# Altium schematic sheet 5_移位寄存器部分.schdoc.schdoc
size 431 x 309 mm; Symbol: Sheet-Symbol_A3; Device: Sheet-Symbol_A3; Company: 深圳嘉立创科技发展有限公司; Drawed: 嘉立创EDA; Reviewed: 嘉立创EDA; Version: V0.1; Page Size: A2; @Project Name: 毕业设计板子1; @Page Count: 3; @Update Date: 2024-02-22; @Create Date: 2024-02-22; @Schematic Name: Schematic1; Part Number: JLCPCB-001; @Page No: 3; @Page Name: 移位寄存器部分
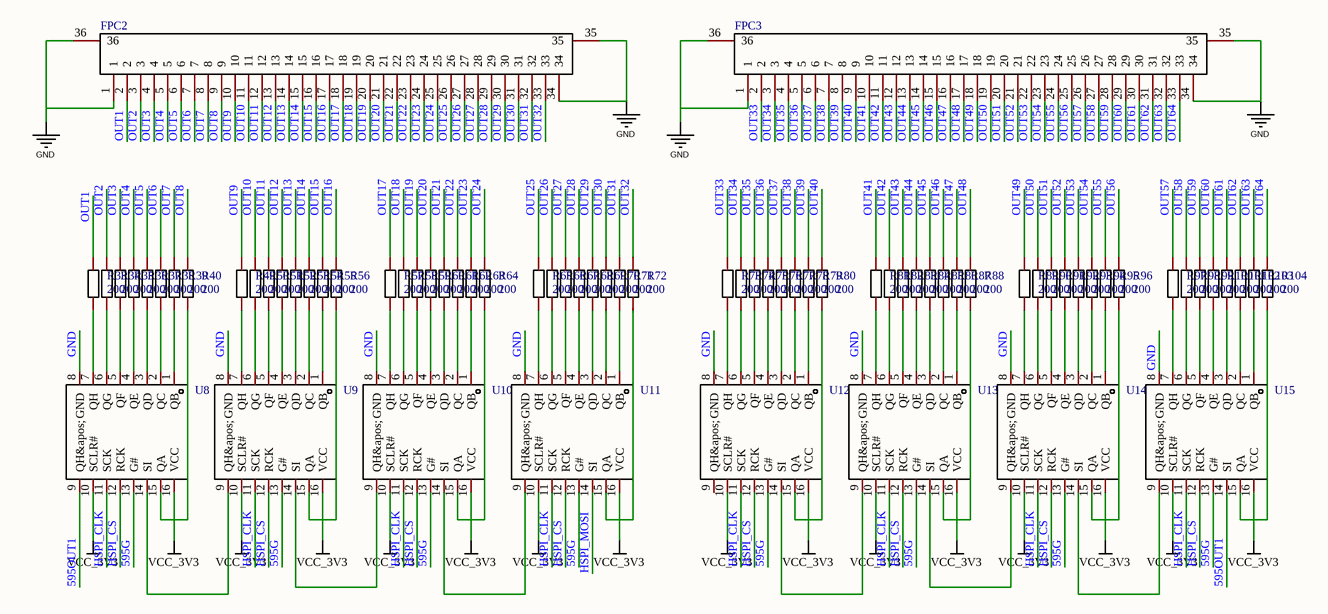
[diagram p0: 5_移位寄存器部分.schdoc.schdoc]

## Parts
FPC2  AFC07-S34FCC-00  [FPC-SMD_P0.50-34P_LCSXJ-H2.0]  (value not drawn)
FPC3  AFC07-S34FCC-00  [FPC-SMD_P0.50-34P_LCSXJ-H2.0]  (value not drawn)
R33  value 200  [R0402]  (hidden comment: Res_0402)
R34  value 200  [R0402]  (hidden comment: Res_0402)
R35  value 200  [R0402]  (hidden comment: Res_0402)
R36  value 200  [R0402]  (hidden comment: Res_0402)
R37  value 200  [R0402]  (hidden comment: Res_0402)
R38  value 200  [R0402]  (hidden comment: Res_0402)
R39  value 200  [R0402]  (hidden comment: Res_0402)
R40  value 200  [R0402]  (hidden comment: Res_0402)
R49  value 200  [R0402]  (hidden comment: Res_0402)
R50  value 200  [R0402]  (hidden comment: Res_0402)
R51  value 200  [R0402]  (hidden comment: Res_0402)
R52  value 200  [R0402]  (hidden comment: Res_0402)
R53  value 200  [R0402]  (hidden comment: Res_0402)
R54  value 200  [R0402]  (hidden comment: Res_0402)
R55  value 200  [R0402]  (hidden comment: Res_0402)
R56  value 200  [R0402]  (hidden comment: Res_0402)
R57  value 200  [R0402]  (hidden comment: Res_0402)
R58  value 200  [R0402]  (hidden comment: Res_0402)
R59  value 200  [R0402]  (hidden comment: Res_0402)
R60  value 200  [R0402]  (hidden comment: Res_0402)
R61  value 200  [R0402]  (hidden comment: Res_0402)
R62  value 200  [R0402]  (hidden comment: Res_0402)
R63  value 200  [R0402]  (hidden comment: Res_0402)
R64  value 200  [R0402]  (hidden comment: Res_0402)
R65  value 200  [R0402]  (hidden comment: Res_0402)
R66  value 200  [R0402]  (hidden comment: Res_0402)
R67  value 200  [R0402]  (hidden comment: Res_0402)
R68  value 200  [R0402]  (hidden comment: Res_0402)
R69  value 200  [R0402]  (hidden comment: Res_0402)
R70  value 200  [R0402]  (hidden comment: Res_0402)
R71  value 200  [R0402]  (hidden comment: Res_0402)
R72  value 200  [R0402]  (hidden comment: Res_0402)
R73  value 200  [R0402]  (hidden comment: Res_0402)
R74  value 200  [R0402]  (hidden comment: Res_0402)
R75  value 200  [R0402]  (hidden comment: Res_0402)
R76  value 200  [R0402]  (hidden comment: Res_0402)
R77  value 200  [R0402]  (hidden comment: Res_0402)
R78  value 200  [R0402]  (hidden comment: Res_0402)
R79  value 200  [R0402]  (hidden comment: Res_0402)
R80  value 200  [R0402]  (hidden comment: Res_0402)
R81  value 200  [R0402]  (hidden comment: Res_0402)
R82  value 200  [R0402]  (hidden comment: Res_0402)
R83  value 200  [R0402]  (hidden comment: Res_0402)
R84  value 200  [R0402]  (hidden comment: Res_0402)
R85  value 200  [R0402]  (hidden comment: Res_0402)
R86  value 200  [R0402]  (hidden comment: Res_0402)
R87  value 200  [R0402]  (hidden comment: Res_0402)
R88  value 200  [R0402]  (hidden comment: Res_0402)
R89  value 200  [R0402]  (hidden comment: Res_0402)
R90  value 200  [R0402]  (hidden comment: Res_0402)
R91  value 200  [R0402]  (hidden comment: Res_0402)
R92  value 200  [R0402]  (hidden comment: Res_0402)
R93  value 200  [R0402]  (hidden comment: Res_0402)
R94  value 200  [R0402]  (hidden comment: Res_0402)
R95  value 200  [R0402]  (hidden comment: Res_0402)
R96  value 200  [R0402]  (hidden comment: Res_0402)
R97  value 200  [R0402]  (hidden comment: Res_0402)
R98  value 200  [R0402]  (hidden comment: Res_0402)
R99  value 200  [R0402]  (hidden comment: Res_0402)
R100  value 200  [R0402]  (hidden comment: Res_0402)
R101  value 200  [R0402]  (hidden comment: Res_0402)
R102  value 200  [R0402]  (hidden comment: Res_0402)
R103  value 200  [R0402]  (hidden comment: Res_0402)
R104  value 200  [R0402]  (hidden comment: Res_0402)
U8  74HC595D_C431479  [SOIC-16_L9.9-W3.9-P1.27-LS6.0-BL]  (value not drawn)
U9  74HC595D_C431479  [SOIC-16_L9.9-W3.9-P1.27-LS6.0-BL]  (value not drawn)
U10  74HC595D_C431479  [SOIC-16_L9.9-W3.9-P1.27-LS6.0-BL]  (value not drawn)
U11  74HC595D_C431479  [SOIC-16_L9.9-W3.9-P1.27-LS6.0-BL]  (value not drawn)
U12  74HC595D_C431479  [SOIC-16_L9.9-W3.9-P1.27-LS6.0-BL]  (value not drawn)
U13  74HC595D_C431479  [SOIC-16_L9.9-W3.9-P1.27-LS6.0-BL]  (value not drawn)
U14  74HC595D_C431479  [SOIC-16_L9.9-W3.9-P1.27-LS6.0-BL]  (value not drawn)
U15  74HC595D_C431479  [SOIC-16_L9.9-W3.9-P1.27-LS6.0-BL]  (value not drawn)

## Nets
GND: FPC2.1 FPC2.34 FPC2.35 FPC2.36 FPC3.1 FPC3.34 FPC3.35 FPC3.36 U8.8(GND) U9.8(GND) U10.8(GND) U11.8(GND) U12.8(GND) U13.8(GND) U14.8(GND) U15.8(GND)
VCC_3V3: U8.10(SCLR#) U8.16(VCC) U9.10(SCLR#) U9.16(VCC) U10.10(SCLR#) U10.16(VCC) U11.10(SCLR#) U11.16(VCC) U12.10(SCLR#) U12.16(VCC) U13.10(SCLR#) U13.16(VCC) U14.10(SCLR#) U14.16(VCC) U15.10(SCLR#) U15.16(VCC)
595G: U8.13(G#) U9.13(G#) U10.13(G#) U11.13(G#) U12.13(G#) U13.13(G#) U14.13(G#) U15.13(G#)
595OUT1: U8.9(QH&apos;) U15.14(SI)
HSPI_CLK: U8.11(SCK) U9.11(SCK) U10.11(SCK) U11.11(SCK) U12.11(SCK) U13.11(SCK) U14.11(SCK) U15.11(SCK)
HSPI_CS: U8.12(RCK) U9.12(RCK) U10.12(RCK) U11.12(RCK) U12.12(RCK) U13.12(RCK) U14.12(RCK) U15.12(RCK)
HSPI_MOSI: U11.14(SI)
OUT1: FPC2.2 R33.2
OUT2: FPC2.3 R34.2
OUT3: FPC2.4 R35.2
OUT4: FPC2.5 R36.2
OUT5: FPC2.6 R37.2
OUT6: FPC2.7 R38.2
OUT7: FPC2.8 R39.2
OUT8: FPC2.9 R40.2
OUT9: FPC2.10 R49.2
OUT10: FPC2.11 R50.2
OUT11: FPC2.12 R51.2
OUT12: FPC2.13 R52.2
OUT13: FPC2.14 R53.2
OUT14: FPC2.15 R54.2
OUT15: FPC2.16 R55.2
OUT16: FPC2.17 R56.2
OUT17: FPC2.18 R57.2
OUT18: FPC2.19 R58.2
OUT19: FPC2.20 R59.2
OUT20: FPC2.21 R60.2
OUT21: FPC2.22 R61.2
OUT22: FPC2.23 R62.2
OUT23: FPC2.24 R63.2
OUT24: FPC2.25 R64.2
OUT25: FPC2.26 R65.2
OUT26: FPC2.27 R66.2
OUT27: FPC2.28 R67.2
OUT28: FPC2.29 R68.2
OUT29: FPC2.30 R69.2
OUT30: FPC2.31 R70.2
OUT31: FPC2.32 R71.2
OUT32: FPC2.33 R72.2
OUT33: FPC3.2 R73.2
OUT34: FPC3.3 R74.2
OUT35: FPC3.4 R75.2
OUT36: FPC3.5 R76.2
OUT37: FPC3.6 R77.2
OUT38: FPC3.7 R78.2
OUT39: FPC3.8 R79.2
OUT40: FPC3.9 R80.2
OUT41: FPC3.10 R81.2
OUT42: FPC3.11 R82.2
OUT43: FPC3.12 R83.2
OUT44: FPC3.13 R84.2
OUT45: FPC3.14 R85.2
OUT46: FPC3.15 R86.2
OUT47: FPC3.16 R87.2
OUT48: FPC3.17 R88.2
OUT49: FPC3.18 R89.2
OUT50: FPC3.19 R90.2
OUT51: FPC3.20 R91.2
OUT52: FPC3.21 R92.2
OUT53: FPC3.22 R93.2
OUT54: FPC3.23 R94.2
OUT55: FPC3.24 R95.2
OUT56: FPC3.25 R96.2
OUT57: FPC3.26 R97.2
OUT58: FPC3.27 R98.2
OUT59: FPC3.28 R99.2
OUT60: FPC3.29 R100.2
OUT61: FPC3.30 R101.2
OUT62: FPC3.31 R102.2
OUT63: FPC3.32 R103.2
OUT64: FPC3.33 R104.2
NetR33_1: R33.1 U8.7(QH)
NetR34_1: R34.1 U8.6(QG)
NetR35_1: R35.1 U8.5(QF)
NetR36_1: R36.1 U8.4(QE)
NetR37_1: R37.1 U8.3(QD)
NetR38_1: R38.1 U8.2(QC)
NetR39_1: R39.1 U8.1(QB)
NetR40_1: R40.1 U8.15(QA)
NetR49_1: R49.1 U9.7(QH)
NetR50_1: R50.1 U9.6(QG)
NetR51_1: R51.1 U9.5(QF)
NetR52_1: R52.1 U9.4(QE)
NetR53_1: R53.1 U9.3(QD)
NetR54_1: R54.1 U9.2(QC)
NetR55_1: R55.1 U9.1(QB)
NetR56_1: R56.1 U9.15(QA)
NetR57_1: R57.1 U10.7(QH)
NetR58_1: R58.1 U10.6(QG)
NetR59_1: R59.1 U10.5(QF)
NetR60_1: R60.1 U10.4(QE)
NetR61_1: R61.1 U10.3(QD)
NetR62_1: R62.1 U10.2(QC)
NetR63_1: R63.1 U10.1(QB)
NetR64_1: R64.1 U10.15(QA)
NetR65_1: R65.1 U11.7(QH)
NetR66_1: R66.1 U11.6(QG)
NetR67_1: R67.1 U11.5(QF)
NetR68_1: R68.1 U11.4(QE)
NetR69_1: R69.1 U11.3(QD)
NetR70_1: R70.1 U11.2(QC)
NetR71_1: R71.1 U11.1(QB)
NetR72_1: R72.1 U11.15(QA)
NetR73_1: R73.1 U12.7(QH)
NetR74_1: R74.1 U12.6(QG)
NetR75_1: R75.1 U12.5(QF)
NetR76_1: R76.1 U12.4(QE)
NetR77_1: R77.1 U12.3(QD)
NetR78_1: R78.1 U12.2(QC)
NetR79_1: R79.1 U12.1(QB)
NetR80_1: R80.1 U12.15(QA)
NetR81_1: R81.1 U13.7(QH)
NetR82_1: R82.1 U13.6(QG)
NetR83_1: R83.1 U13.5(QF)
NetR84_1: R84.1 U13.4(QE)
NetR85_1: R85.1 U13.3(QD)
NetR86_1: R86.1 U13.2(QC)
NetR87_1: R87.1 U13.1(QB)
NetR88_1: R88.1 U13.15(QA)
NetR89_1: R89.1 U14.7(QH)
NetR90_1: R90.1 U14.6(QG)
NetR91_1: R91.1 U14.5(QF)
NetR92_1: R92.1 U14.4(QE)
NetR93_1: R93.1 U14.3(QD)
NetR94_1: R94.1 U14.2(QC)
NetR95_1: R95.1 U14.1(QB)
NetR96_1: R96.1 U14.15(QA)
NetR97_1: R97.1 U15.7(QH)
NetR98_1: R98.1 U15.6(QG)
NetR99_1: R99.1 U15.5(QF)
NetR100_1: R100.1 U15.4(QE)
NetR101_1: R101.1 U15.3(QD)
NetR102_1: R102.1 U15.2(QC)
NetR103_1: R103.1 U15.1(QB)
NetR104_1: R104.1 U15.15(QA)
NetU8_14: U8.14(SI) U9.9(QH&apos;)
NetU9_14: U9.14(SI) U10.9(QH&apos;)
NetU10_14: U10.14(SI) U11.9(QH&apos;)
NetU12_14: U12.14(SI) U13.9(QH&apos;)
NetU13_14: U13.14(SI) U14.9(QH&apos;)
NetU14_14: U14.14(SI) U15.9(QH&apos;)

Not connected (* = marked no-connect by the designer): U12 9(QH&apos;)

## Notes on the sheet
- 1
- 2
- 3
- 4
- 5
- 6
- A
- B
- C
- 原理图
- Schematic1
- 创建日期
- 更新日期
- 2024-02-22
- D
- 审阅
- 绘制
- 图页
- 嘉立创EDA
- 移位寄存器部分
- 物料编码
- 毕业设计板子1
- JLCPCB-001
- 版本
- 尺寸
- 页
- 共
- V0.1
- A2
- 深圳嘉立创科技发展有限公司

## Library data of the parts
FPC2 FPC3 = AFC07-S34FCC-00: Manufacturer: JS(钜硕电子); Add into BOM: yes; Locking Feature: 抽屉式; Number of Contacts: 34P; Pitch: 0.5mm; FFC, FCB Thickness: 0.3mm; Description: 锁定特性:抽屉式;触点类型:下接;触点数量:34P;间距:0.5mm;安装类型:卧贴;; Symbol: AFC07-S34FCC-00; Device: AFC07-S34FCC-00; Supplier: LCSC; Supplier Part: C262221; Manufacturer Part: AFC07-S34FCC-00; JLCPCB Part Class: 扩展库; LCSC Part Name: 间距:0.5mm P数:34P 抽屉式 下接; Supplier Footprint: SMD,P=0.5mm,卧贴; Datasheet: https://atta.szlcsc.com/upload/public/pdf/source/20190726/C11047_78689421E6D6672DE8D11ECCF89B3729.pdf; Convert to PCB: yes; Contact Type: 下接; Mounting Type: 卧贴; Height Above Board: 2mm
R33-R40 R49-R104 = Res_0402: Symbol: 电阻; Convert to PCB: yes; Device: Res_0402; Add into BOM: yes; Supplier Footprint: 0402
U8-U15 = 74HC595D_C431479: Manufacturer: TOSHIBA(东芝); Add into BOM: yes; Function: 串行至串行或并行; Supply Voltage: 2V~6V; Number of Elements: 1; Number of Bits per Element: 8; Output Type: 三态; Description: 功能:串行至串行或并行;电源电压:2V~6V;元件数:1;每个元件位数:8;; Symbol: 74HC595D_C431479; Device: 74HC595D_C431479; LCSC Part Name: 三态输出 串行至串行或并行移位寄存器; Supplier Part: C431479; Manufacturer Part: 74HC595D; Supplier Footprint: SOIC-16; JLCPCB Part Class: 扩展库; Datasheet: https://atta.szlcsc.com/upload/public/pdf/source/20190920/C431479_35AD716FF5894FB7E9B0D7A2C001D0DE.pdf; Supplier: LCSC; Convert to PCB: yes; Series: 74HC; Operating Temperature: -40℃~+125℃